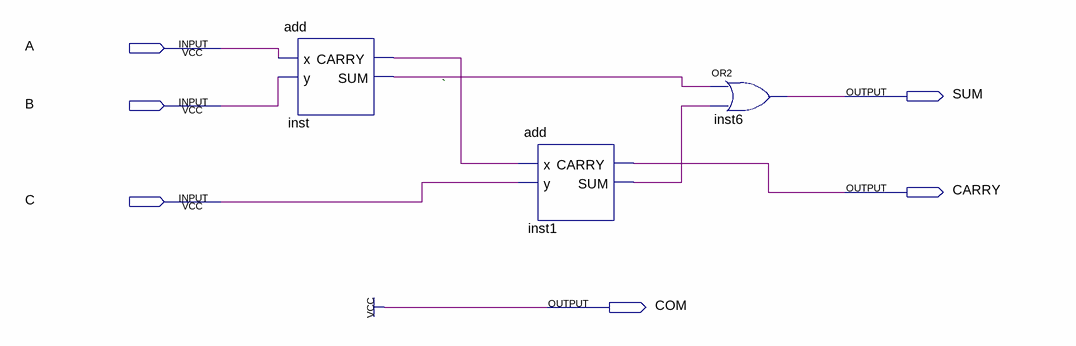
[diagram p0: schematic sheet]
// Quartus schematic full adder.bdf as structural Verilog: 3 symbols, 6 pins
module \full_adder  (
  input  A,
  input  B,
  input  C,
  output SUM,
  output CARRY,
  output COM
);

  wire inst1_sum, inst_carry, inst_sum;

  add inst (.x(A), .y(B), .CARRY(inst_carry), .SUM(inst_sum));
  add inst1 (.x(inst_carry), .y(C), .CARRY(CARRY), .SUM(inst1_sum));
  or inst6 (SUM, inst_sum, inst1_sum);

  assign COM = 1'b1;

  // Notes on the sheet:
  //   `
endmodule
